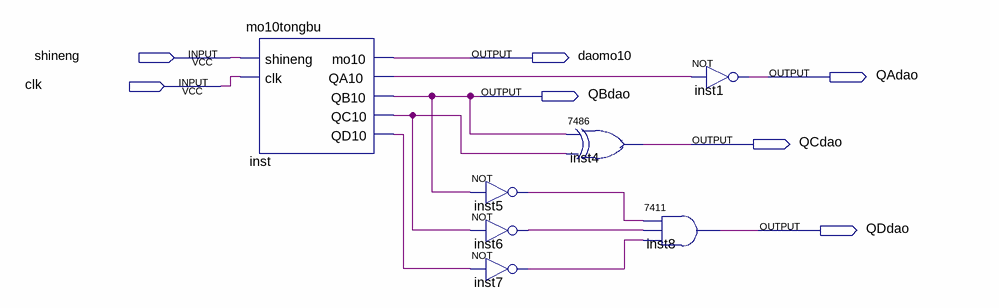
[diagram p0: schematic sheet]
// Quartus schematic daomo10.bdf as structural Verilog: 7 symbols, 7 pins
module daomo10 (
  input  shineng,
  input  clk,
  output daomo10,
  output QAdao,
  output QBdao,
  output QCdao,
  output QDdao
);

  wire inst5_out, inst6_out, inst7_out, inst_qa10, inst_qc10, inst_qd10;

  mo10tongbu inst (
    .shineng(shineng), .clk(clk), .mo10(daomo10), .QA10(inst_qa10), .QB10(QBdao), .QC10(inst_qc10),
    .QD10(inst_qd10));
  not inst5 (inst5_out, QBdao);
  not inst6 (inst6_out, inst_qc10);
  not inst7 (inst7_out, inst_qd10);
  \7486  inst4 (.\2 (QBdao), .\3 (inst_qc10), .\1 (QCdao));
  not inst1 (QAdao, inst_qa10);
  \7411  inst8 (.\2 (inst5_out), .\3 (inst6_out), .\4 (inst7_out), .\1 (QDdao));
endmodule
